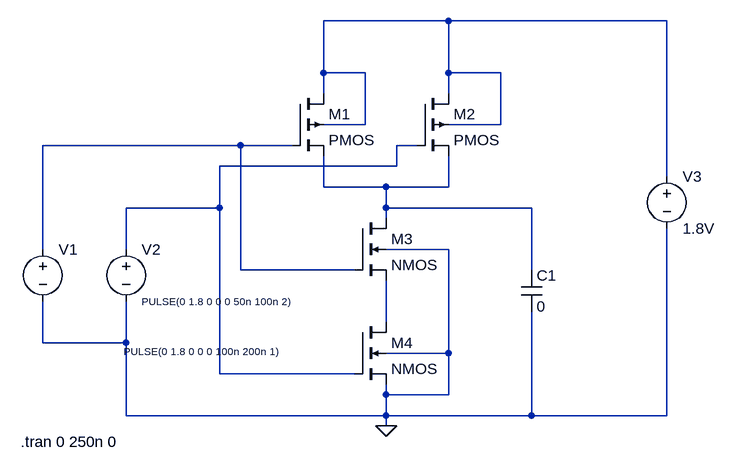
[diagram p0: schematic nand.asc]
nand.asc, the LTspice schematic file:
Version 4
SHEET 1 880 680
WIRE 272 -32 80 -32
WIRE 608 -32 272 -32
WIRE 80 48 80 -32
WIRE 144 48 80 48
WIRE 272 48 272 -32
WIRE 352 48 272 48
WIRE 80 80 80 48
WIRE 272 80 272 48
WIRE 144 128 144 48
WIRE 144 128 80 128
WIRE 352 128 352 48
WIRE 352 128 272 128
WIRE -48 160 -352 160
WIRE 32 160 -48 160
WIRE 224 160 192 160
WIRE 192 192 192 160
WIRE 192 192 -80 192
WIRE 608 208 608 -32
WIRE 80 224 80 176
WIRE 176 224 80 224
WIRE 272 224 272 176
WIRE 272 224 176 224
WIRE -80 256 -80 192
WIRE -80 256 -224 256
WIRE 176 256 176 224
WIRE 400 256 176 256
WIRE 176 272 176 256
WIRE -352 320 -352 160
WIRE -224 320 -224 256
WIRE 272 320 176 320
WIRE -48 352 -48 160
WIRE 128 352 -48 352
WIRE 400 352 400 256
WIRE 176 432 176 368
WIRE -352 464 -352 400
WIRE -224 464 -224 400
WIRE -224 464 -352 464
WIRE 272 480 272 320
WIRE 272 480 176 480
WIRE -80 512 -80 256
WIRE 128 512 -80 512
WIRE 176 544 176 528
WIRE 272 544 272 480
WIRE 272 544 176 544
WIRE -224 576 -224 464
WIRE 176 576 176 544
WIRE 176 576 -224 576
WIRE 400 576 400 416
WIRE 400 576 176 576
WIRE 608 576 608 288
WIRE 608 576 400 576
WIRE 176 592 176 576
FLAG 176 592 0
SYMBOL nmos4 128 272 R0
SYMATTR InstName M3
SYMATTR Value2 l=180n w=400n
SYMBOL nmos4 128 432 R0
SYMATTR InstName M4
SYMATTR Value2 l=180n w=400n
SYMBOL voltage -352 304 R0
WINDOW 123 0 0 Left 0
WINDOW 39 0 0 Left 0
WINDOW 3 241 163 Top 1
SYMATTR InstName V1
SYMATTR Value PULSE(0 1.8 0 0 0 100n 200n 1)
SYMBOL voltage -224 304 R0
WINDOW 3 24 96 Left 1
WINDOW 123 0 0 Left 0
WINDOW 39 0 0 Left 0
SYMATTR InstName V2
SYMATTR Value PULSE(0 1.8 0 0 0 50n 100n 2)
SYMBOL voltage 608 192 R0
WINDOW 123 0 0 Left 0
WINDOW 39 0 0 Left 0
SYMATTR InstName V3
SYMATTR Value 1.8V
SYMBOL cap 384 352 R0
SYMATTR InstName C1
SYMATTR Value 0
SYMBOL pmos4 32 80 R0
SYMATTR InstName M1
SYMATTR Value2 l=180n w=400n
SYMBOL pmos4 224 80 R0
SYMATTR InstName M2
SYMATTR Value2 l=180n w=400n
TEXT -386 616 Left 2 !.tran 0 250n 0

The netlist it stands for:
* nand.asc
M3 N004 N002 N005 0 NMOS l=180n w=400n
M4 N005 N003 0 0 NMOS l=180n w=400n
V1 N002 0 PULSE(0 1.8 0 0 0 100n 200n 1)
V2 N003 0 PULSE(0 1.8 0 0 0 50n 100n 2)
V3 N001 0 1.8V
C1 N004 0 0
M1 N001 N002 N004 N001 PMOS l=180n w=400n
M2 N001 N003 N004 N001 PMOS l=180n w=400n
.model NMOS NMOS
.model PMOS PMOS
.lib standard.mos
.tran 0 250n 0
.backanno
.end